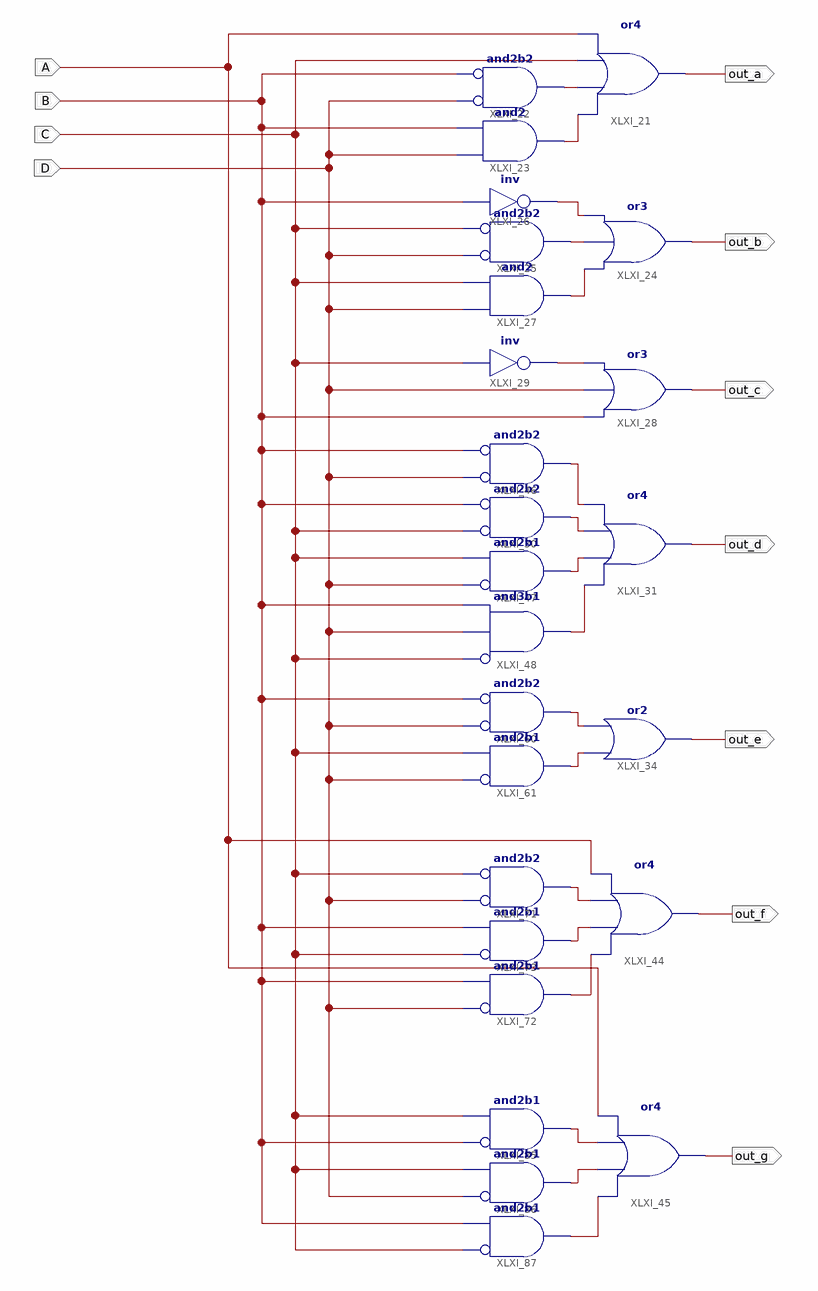
[diagram p0: schematic sheet 1]
// Xilinx ISE schematic BCD27SEG.sch (spartan6) as structural Verilog: 25 symbols, 11 ports
module BCD27SEG (
  input  A,
  input  C,
  input  D,
  input  B,
  output out_a,
  output out_b,
  output out_c,
  output out_d,
  output out_e,
  output out_f,
  output out_g
);

  wire XLXN_16, XLXN_17, XLXN_18, XLXN_19, XLXN_20, XLXN_21, XLXN_22, XLXN_23, XLXN_25, XLXN_26, XLXN_58,
       XLXN_59, XLXN_71, XLXN_72, XLXN_73, XLXN_92, XLXN_93, XLXN_94;

  or XLXI_21 (out_a, XLXN_17, XLXN_16, C, A);
  and XLXI_22 (XLXN_16, ~D, ~B);  // and2b2
  and XLXI_23 (XLXN_17, D, B);
  or XLXI_24 (out_b, XLXN_20, XLXN_19, XLXN_18);
  and XLXI_25 (XLXN_19, ~D, ~C);  // and2b2
  not XLXI_26 (XLXN_18, B);
  and XLXI_27 (XLXN_20, D, C);
  or XLXI_28 (out_c, B, D, XLXN_21);
  not XLXI_29 (XLXN_21, C);
  and XLXI_30 (XLXN_22, ~C, ~B);  // and2b2
  or XLXI_31 (out_d, XLXN_26, XLXN_25, XLXN_22, XLXN_23);
  and XLXI_46 (XLXN_23, ~D, ~B);  // and2b2
  and XLXI_47 (XLXN_25, ~D, C);  // and2b1
  and XLXI_48 (XLXN_26, ~C, D, B);  // and3b1
  and XLXI_60 (XLXN_58, ~D, ~B);  // and2b2
  and XLXI_61 (XLXN_59, ~D, C);  // and2b1
  or XLXI_34 (out_e, XLXN_59, XLXN_58);
  and XLXI_73 (XLXN_72, ~C, B);  // and2b1
  and XLXI_72 (XLXN_73, ~D, B);  // and2b1
  and XLXI_71 (XLXN_71, ~D, ~C);  // and2b2
  and XLXI_85 (XLXN_92, ~B, C);  // and2b1
  and XLXI_86 (XLXN_93, ~D, C);  // and2b1
  and XLXI_87 (XLXN_94, ~C, B);  // and2b1
  or XLXI_44 (out_f, XLXN_73, XLXN_72, XLXN_71, A);
  or XLXI_45 (out_g, XLXN_94, XLXN_93, XLXN_92, A);
endmodule
